# Altium schematic sheet Relays.SchDoc
size A4; SheetNumber: 4; SheetTotal: 7
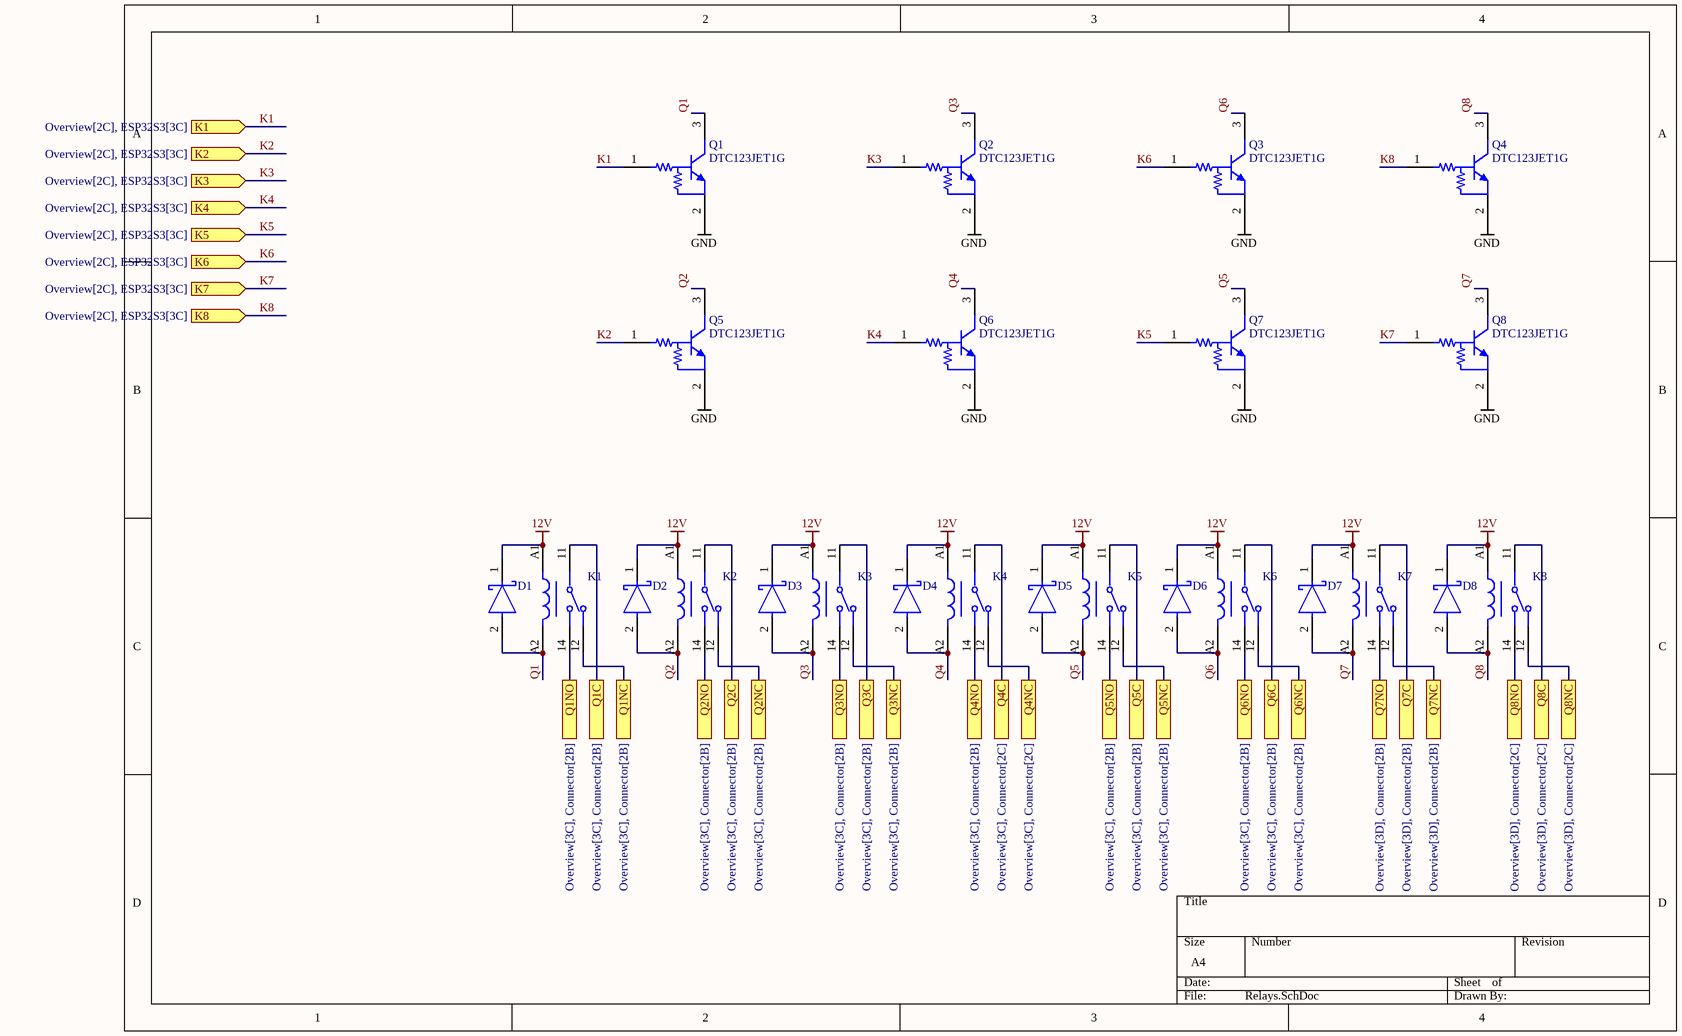
[diagram p0: Relays.SchDoc]

## Parts
D1  SBR80520LT1G  [FP-425-04-MFG]  (value not drawn)
D2  SBR80520LT1G  [FP-425-04-MFG]  (value not drawn)
D3  SBR80520LT1G  [FP-425-04-MFG]  (value not drawn)
D4  SBR80520LT1G  [FP-425-04-MFG]  (value not drawn)
D5  SBR80520LT1G  [FP-425-04-MFG]  (value not drawn)
D6  SBR80520LT1G  [FP-425-04-MFG]  (value not drawn)
D7  SBR80520LT1G  [FP-425-04-MFG]  (value not drawn)
D8  SBR80520LT1G  [FP-425-04-MFG]  (value not drawn)
K1  7-1415899-7  [FP-7-1415899-7-MFG]  (value not drawn)
K2  7-1415899-7  [FP-7-1415899-7-MFG]  (value not drawn)
K3  7-1415899-7  [FP-7-1415899-7-MFG]  (value not drawn)
K4  7-1415899-7  [FP-7-1415899-7-MFG]  (value not drawn)
K5  7-1415899-7  [FP-7-1415899-7-MFG]  (value not drawn)
K6  7-1415899-7  [FP-7-1415899-7-MFG]  (value not drawn)
K7  7-1415899-7  [FP-7-1415899-7-MFG]  (value not drawn)
K8  7-1415899-7  [FP-7-1415899-7-MFG]  (value not drawn)
Q1  DTC123JET1G  [ONSC-SC-75-3-463-01_V]
Q2  DTC123JET1G  [ONSC-SC-75-3-463-01_V]
Q3  DTC123JET1G  [ONSC-SC-75-3-463-01_V]
Q4  DTC123JET1G  [ONSC-SC-75-3-463-01_V]
Q5  DTC123JET1G  [ONSC-SC-75-3-463-01_V]
Q6  DTC123JET1G  [ONSC-SC-75-3-463-01_V]
Q7  DTC123JET1G  [ONSC-SC-75-3-463-01_V]
Q8  DTC123JET1G  [ONSC-SC-75-3-463-01_V]

## Ports
K1 (in, see Overview[2C], ESP32S3[3C]), K2 (in, see Overview[2C], ESP32S3[3C]), K3 (in, see Overview[2C], ESP32S3[3C]), K4 (in, see Overview[2C], ESP32S3[3C]), K5 (in, see Overview[2C], ESP32S3[3C]), K6 (in, see Overview[2C], ESP32S3[3C]), K7 (in, see Overview[2C], ESP32S3[3C]), K8 (in, see Overview[2C], ESP32S3[3C]), Q1C (see Overview[3C], Connector[2B]), Q1NC (see Overview[3C], Connector[2B]), Q1NO (see Overview[3C], Connector[2B]), Q2C (see Overview[3C], Connector[2B]), Q2NC (see Overview[3C], Connector[2B]), Q2NO (see Overview[3C], Connector[2B]), Q3C (see Overview[3C], Connector[2B]), Q3NC (see Overview[3C], Connector[2B]), Q3NO (see Overview[3C], Connector[2B]), Q4C (see Overview[3C], Connector[2C]), Q4NC (see Overview[3C], Connector[2C]), Q4NO (see Overview[3C], Connector[2B]), Q5C (see Overview[3C], Connector[2B]), Q5NC (see Overview[3C], Connector[2B]), Q5NO (see Overview[3C], Connector[2B]), Q6C (see Overview[3C], Connector[2B]), Q6NC (see Overview[3C], Connector[2B]), Q6NO (see Overview[3C], Connector[2B]), Q7C (see Overview[3D], Connector[2B]), Q7NC (see Overview[3D], Connector[2B]), Q7NO (see Overview[3D], Connector[2B]), Q8C (see Overview[3D], Connector[2C]), Q8NC (see Overview[3D], Connector[2C]), Q8NO (see Overview[3D], Connector[2C])

## Nets
12V: D1.1(C) D2.1(C) D3.1(C) D4.1(C) D5.1(C) D6.1(C) D7.1(C) D8.1(C) K1.A1 K2.A1 K3.A1 K4.A1 K5.A1 K6.A1 K7.A1 K8.A1
GND: Q1.2(E) Q2.2(E) Q3.2(E) Q4.2(E) Q5.2(E) Q6.2(E) Q7.2(E) Q8.2(E)
K1: Q1.1(B) ; port K1
K2: Q5.1(B) ; port K2
K3: Q2.1(B) ; port K3
K4: Q6.1(B) ; port K4
K5: Q7.1(B) ; port K5
K6: Q3.1(B) ; port K6
K7: Q8.1(B) ; port K7
K8: Q4.1(B) ; port K8
Q1: D1.2(A) K1.A2 Q1.3(C)
Q1C: K1.11 ; port Q1C
Q1NC: K1.12 ; port Q1NC
Q1NO: K1.14 ; port Q1NO
Q2: D2.2(A) K2.A2 Q5.3(C)
Q2C: K2.11 ; port Q2C
Q2NC: K2.12 ; port Q2NC
Q2NO: K2.14 ; port Q2NO
Q3: D3.2(A) K3.A2 Q2.3(C)
Q3C: K3.11 ; port Q3C
Q3NC: K3.12 ; port Q3NC
Q3NO: K3.14 ; port Q3NO
Q4: D4.2(A) K4.A2 Q6.3(C)
Q4C: K4.11 ; port Q4C
Q4NC: K4.12 ; port Q4NC
Q4NO: K4.14 ; port Q4NO
Q5: D5.2(A) K5.A2 Q7.3(C)
Q5C: K5.11 ; port Q5C
Q5NC: K5.12 ; port Q5NC
Q5NO: K5.14 ; port Q5NO
Q6: D6.2(A) K6.A2 Q3.3(C)
Q6C: K6.11 ; port Q6C
Q6NC: K6.12 ; port Q6NC
Q6NO: K6.14 ; port Q6NO
Q7: D7.2(A) K7.A2 Q8.3(C)
Q7C: K7.11 ; port Q7C
Q7NC: K7.12 ; port Q7NC
Q7NO: K7.14 ; port Q7NO
Q8: D8.2(A) K8.A2 Q4.3(C)
Q8C: K8.11 ; port Q8C
Q8NC: K8.12 ; port Q8NC
Q8NO: K8.14 ; port Q8NO

## Library data of the parts
D1-D8 = CMP-1055-00426-2: DIODE SCHOTTKY 20V 500MA SOD123; Forward Voltage: 385mV; Element Configuration: Single; Max Forward Surge Current (Ifsm): 5.5A; Peak Reverse Current: 250uA; Min Operating Temperature: -65°C; Case/Package: SOD-123-2; Halogen Free: Halogen Free; Number of Pins: 2; Max Operating Temperature: 125°C; Average Rectified Current: 500mA; Weight: 0.000363oz; Height: 1.17mm; Reverse Voltage (DC): 20V; Forward Current: 500mA; Max Reverse Voltage (DC): 20V; Width: 1.6mm; Termination: SMD/SMT; Max Repetitive Reverse Voltage (Vrrm): 20V; Package Quantity: 3000; Length: 2.69mm; Lead Free: Lead Free; Peak Non-Repetitive Surge Current: 5.5A; Packaging: Tape and Reel
K1-K8 = CMP-03395-000164-1: RELAY GEN PURPOSE SPDT 16A 12V; Coil Current: 33.33mA; Coil Power: 400mW; Resistance: 360R; Contact Voltage Rating (AC): 250V; Voltage Rating (AC): 400V; Operate Time: 8ms; Coil Voltage (DC): 12V; Throw Configuration: SPDT; Depth: 12.7mm; Height: 15.7mm; Coil Resistance: 360R; Max Operating Temperature: 85°C; ELV: Compliant; Number of Pins: 8; Packaging: Carton; Case/Package: DIP; Min Operating Temperature: -40°C; Width: 12.7mm; Length: 29mm; Contact Material: Silver; Termination: PCB; Contact Current Rating: 16A; Weight: 0.353oz
Q1-Q8 = CMP-0630-00201-1: Digital Transistor (BRT), R1=2.2 kOhm, R2=47 kOhm, NPN Transistor, 3-Pin SC-75, Pb-Free, Tape and Reel; Manufacturer: On Semiconductor; V(BR)CEO Min (V): 50; hFE Min: 80; R1/R2 Typ: 0.047; IC Continuous (A): 0.1; ComponentLink1URL: http://www.onsemi.com/; ComponentLink2URL: http://www.onsemi.cn/pub_link/Collateral/DTC123J-D.PDF; DatasheetVersion: Rev. 1; Mounting Technology: Surface Mount; ComponentLink2Description: Datasheet; PartNumber: DTC123JET1G; PackageDescription: 3-Pin Small Outline Transistor, Body 1.6 x 0.8 mm, Pitch 0.5 mm; Polarity: NPN; PackageVersion: Rev. F, 07/2005; ComponentLink3Description: Package Specification; PackageReference: SC-75-3-463-01; Packing: Tape and Reel; ComponentLink3URL: http://www.onsemi.com/pub_link/Collateral/463-01.PDF; ComponentLink1Description: Manufacturer URL; RoHS: TRUE